# Altium project NC1-2BA.PrjPcb
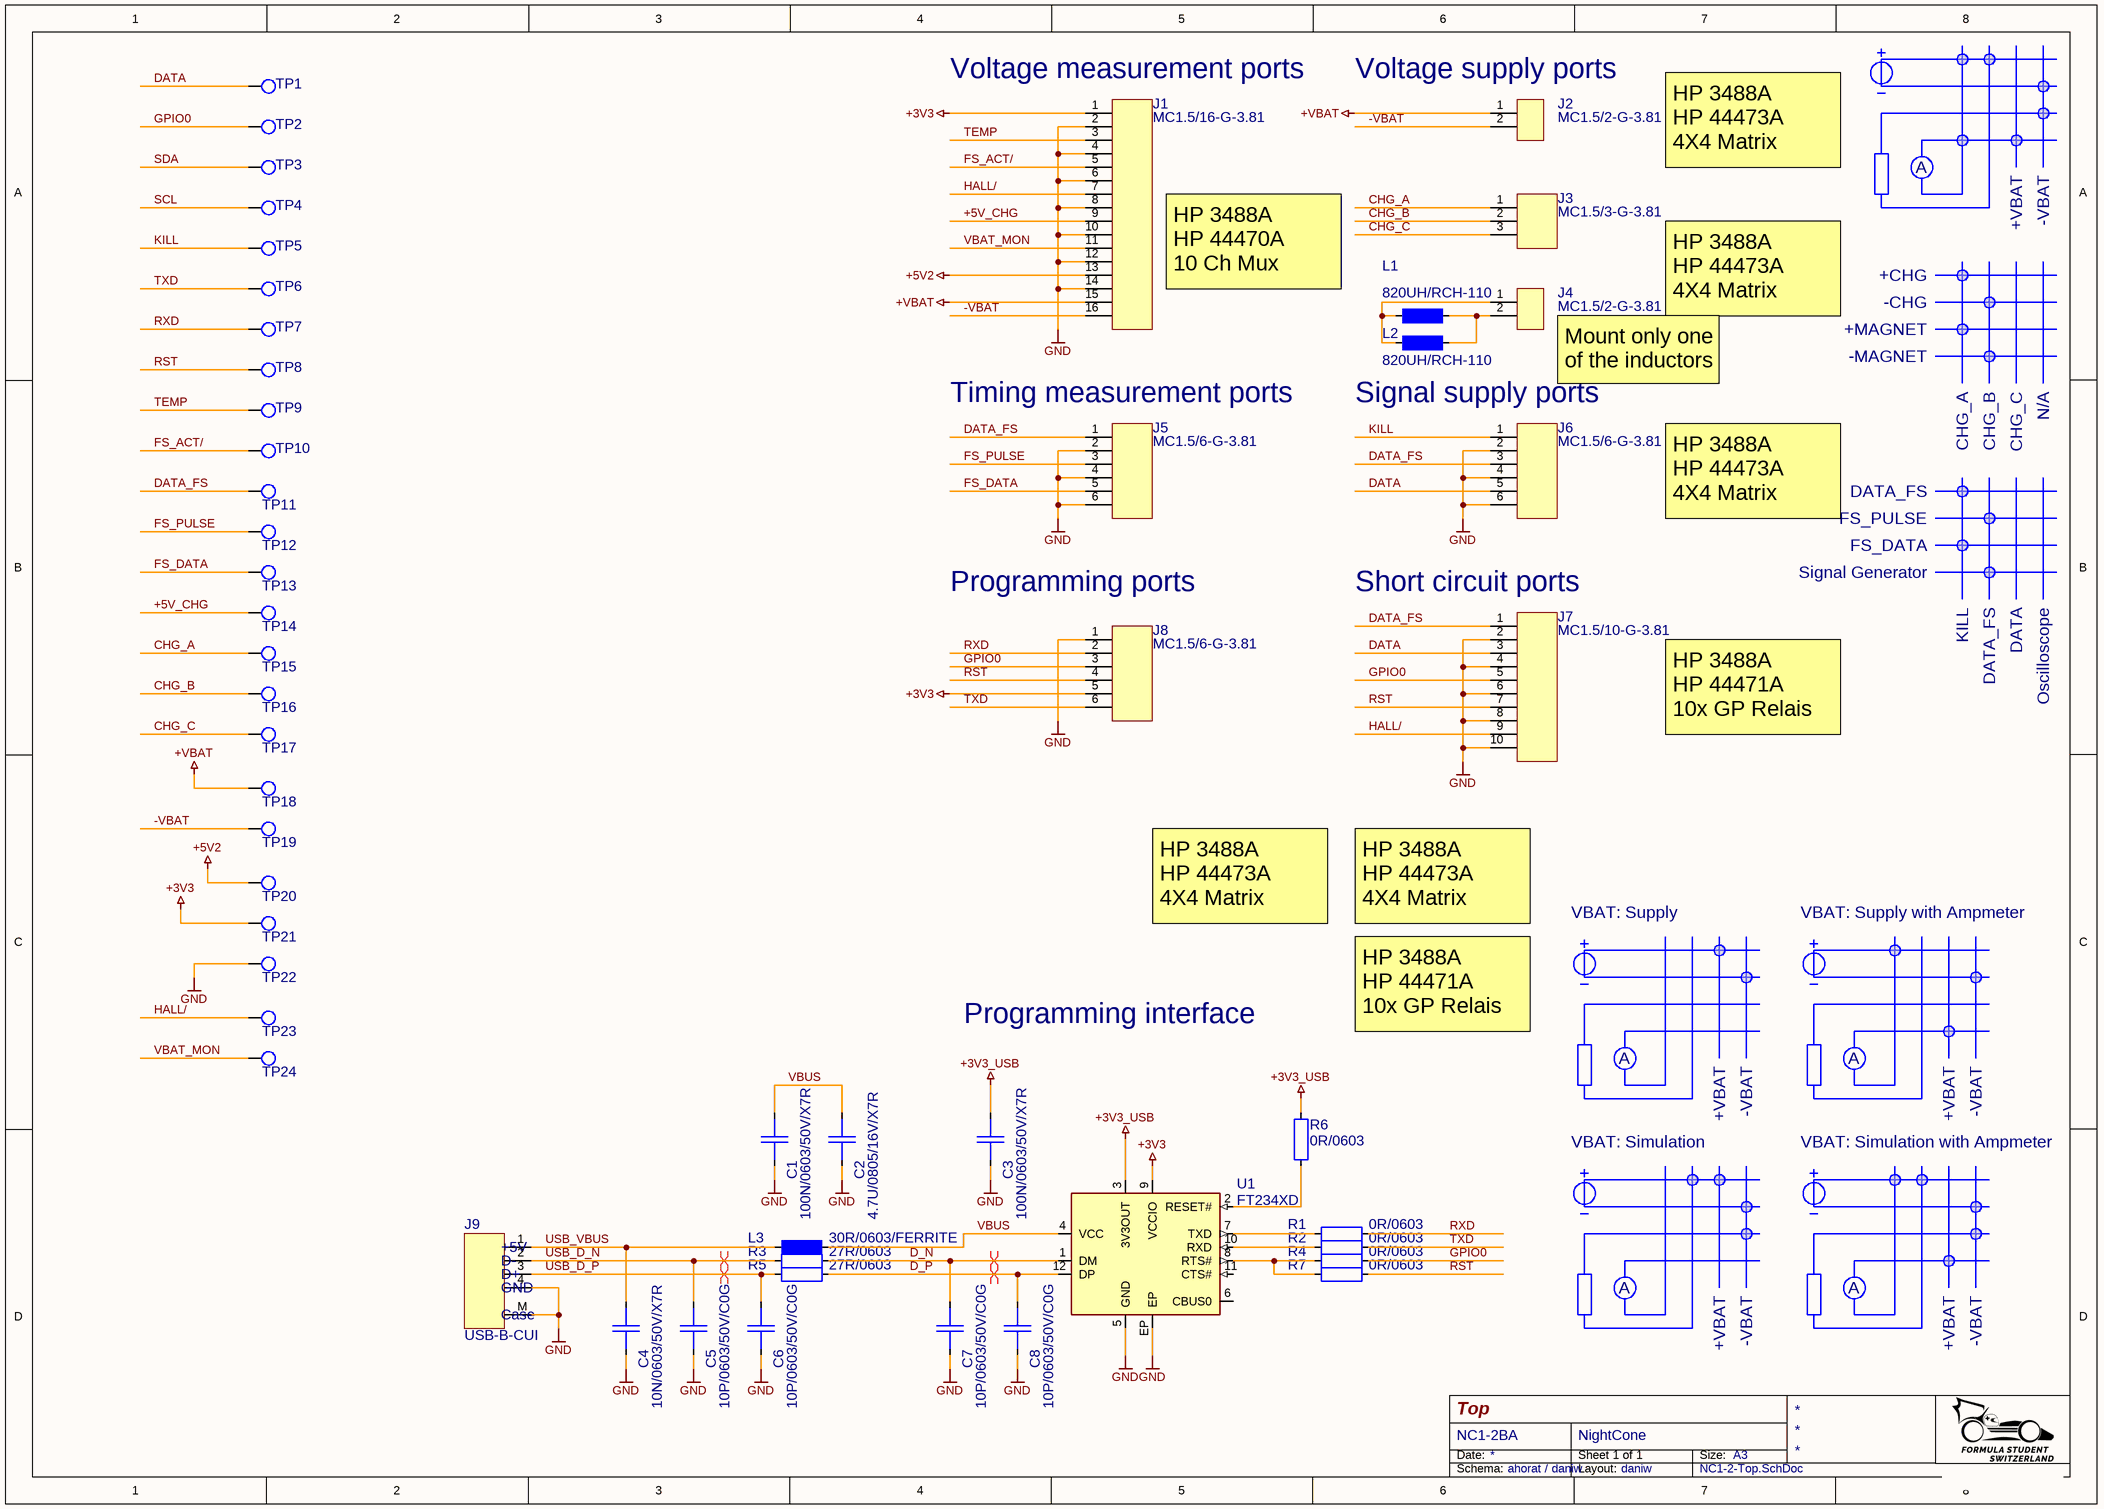
[diagram p0: NC1-2-Top.SchDoc]
Author: ahorat / daniw; Index_Main: B; Index_Sub: A; Layout_Designer: daniw; PCB_NAME: NC1-2; Project: NightCone; Schema_Designer: ahorat / daniw
1 sheet, 52 parts. Net scope: global (net labels, ports and power ports of the same name join across sheets).
Board files: NC1-2B-BASIS.PcbDoc, NC1-2B-PANEL.PcbDoc

## Sheet NC1-2-Top.SchDoc: Top
size A3; SheetNumber: 1; SheetTotal: 1

### Parts
C1  100N/0603/50V/X7R  [CAP0603_X7R]
C2  4.7U/0805/16V/X7R  [CAP0805_X7R]
C3  100N/0603/50V/X7R  [CAP0603_X7R]
C4  10N/0603/50V/X7R  [CAP0603_X7R]
C5  10P/0603/50V/C0G  [CAP0603_C0G]
C6  10P/0603/50V/C0G  [CAP0603_C0G]
C7  10P/0603/50V/C0G  [CAP0603_C0G]
C8  10P/0603/50V/C0G  [CAP0603_C0G]
J1  MC1.5/16-G-3.81  [MC1.5/16-G-3.81]
J2  MC1.5/2-G-3.81  [MC1.5/2-G-3.81]
J3  MC1.5/3-G-3.81  [MC1.5/3-G-3.81]
J4  MC1.5/2-G-3.81  [MC1.5/2-G-3.81]
J5  MC1.5/6-G-3.81  [MC1.5/6-G-3.81]
J6  MC1.5/6-G-3.81  [MC1.5/6-G-3.81]
J7  MC1.5/10-G-3.81  [MC1.5/10-G-3.81]
J8  MC1.5/6-G-3.81  [MC1.5/6-G-3.81]
J9  USB-B-CUI  [USB-B_CUI_UJ2-BH-TH]
L1  820UH/RCH-110  [RCH-110-SINGLE]
L2  820UH/RCH-110  [RCH-110-SINGLE]
L3  30R/0603/FERRITE  [FB0603]
R1  0R/0603  [R0603-0.40-WW]
R2  0R/0603  [R0603-0.40-WW]
R3  27R/0603  [R0603-0.40-WW]
R4  0R/0603  [R0603-0.40-WW]
R5  27R/0603  [R0603-0.40-WW]
R6  0R/0603  [R0603-0.40-WW]
R7  0R/0603  [R0603-0.40-WW]
TP1  SPRING-PROBE-SLEEVE-25  [TP_SPRING_PROBE_S25-512]  (value not drawn)  (no BOM)
TP2  SPRING-PROBE-SLEEVE-25  [TP_SPRING_PROBE_S25-512]  (value not drawn)  (no BOM)
TP3  SPRING-PROBE-SLEEVE-25  [TP_SPRING_PROBE_S25-512]  (value not drawn)  (no BOM)
TP4  SPRING-PROBE-SLEEVE-25  [TP_SPRING_PROBE_S25-512]  (value not drawn)  (no BOM)
TP5  SPRING-PROBE-SLEEVE-25  [TP_SPRING_PROBE_S25-512]  (value not drawn)  (no BOM)
TP6  SPRING-PROBE-SLEEVE-25  [TP_SPRING_PROBE_S25-512]  (value not drawn)  (no BOM)
TP7  SPRING-PROBE-SLEEVE-25  [TP_SPRING_PROBE_S25-512]  (value not drawn)  (no BOM)
TP8  SPRING-PROBE-SLEEVE-25  [TP_SPRING_PROBE_S25-512]  (value not drawn)  (no BOM)
TP9  SPRING-PROBE-SLEEVE-25  [TP_SPRING_PROBE_S25-512]  (value not drawn)  (no BOM)
TP10  SPRING-PROBE-SLEEVE-25  [TP_SPRING_PROBE_S25-512]  (value not drawn)  (no BOM)
TP11  SPRING-PROBE-SLEEVE-25  [TP_SPRING_PROBE_S25-512]  (value not drawn)  (no BOM)
TP12  SPRING-PROBE-SLEEVE-25  [TP_SPRING_PROBE_S25-512]  (value not drawn)  (no BOM)
TP13  SPRING-PROBE-SLEEVE-25  [TP_SPRING_PROBE_S25-512]  (value not drawn)  (no BOM)
TP14  SPRING-PROBE-SLEEVE-25  [TP_SPRING_PROBE_S25-512]  (value not drawn)  (no BOM)
TP15  SPRING-PROBE-SLEEVE-25  [TP_SPRING_PROBE_S25-512]  (value not drawn)  (no BOM)
TP16  SPRING-PROBE-SLEEVE-25  [TP_SPRING_PROBE_S25-512]  (value not drawn)  (no BOM)
TP17  SPRING-PROBE-SLEEVE-25  [TP_SPRING_PROBE_S25-512]  (value not drawn)  (no BOM)
TP18  SPRING-PROBE-SLEEVE-25  [TP_SPRING_PROBE_S25-512]  (value not drawn)  (no BOM)
TP19  SPRING-PROBE-SLEEVE-25  [TP_SPRING_PROBE_S25-512]  (value not drawn)  (no BOM)
TP20  SPRING-PROBE-SLEEVE-25  [TP_SPRING_PROBE_S25-512]  (value not drawn)  (no BOM)
TP21  SPRING-PROBE-SLEEVE-25  [TP_SPRING_PROBE_S25-512]  (value not drawn)  (no BOM)
TP22  SPRING-PROBE-SLEEVE-25  [TP_SPRING_PROBE_S25-512]  (value not drawn)  (no BOM)
TP23  SPRING-PROBE-SLEEVE-25  [TP_SPRING_PROBE_S25-512]  (value not drawn)  (no BOM)
TP24  SPRING-PROBE-SLEEVE-25  [TP_SPRING_PROBE_S25-512]  (value not drawn)  (no BOM)
U1  FT234XD  [DFN045P300X300X080-12-EP160X250]

### Nets
+3V3: J1.1 J8.5 TP21.1 U1.9(VCCIO)
+3V3_USB: C3.1 R6.1 U1.3(3V3OUT)
+5V2: J1.13 TP20.1
+VBAT: J1.15 J2.1 TP18.1
GND: C1.2 C2.2 C3.2 C4.2 C5.2 C6.2 C7.2 C8.2 J1.2 J1.4 J1.6 J1.8 J1.10 J1.12 J1.14 J5.2 J5.4 J5.6 J6.2 J6.4 J6.6 J7.2 J7.4 J7.6 J7.8 J7.10 J8.1 J9.4 J9.M TP22.1 U1.5(GND) U1.EP
+5V_CHG: J1.9 TP14.1
-VBAT: J1.16 J2.2 TP19.1
CHG_A: J3.1 TP15.1
CHG_B: J3.2 TP16.1
CHG_C: J3.3 TP17.1
D_N: C7.1 R3.2 U1.1(DM)
D_P: C8.1 R5.2 U1.12(DP)
DATA: J6.5 J7.3 TP1.1
DATA_FS: J5.1 J6.3 J7.1 TP11.1
FS_ACT/: J1.5 TP10.1
FS_DATA: J5.5 TP13.1
FS_PULSE: J5.3 TP12.1
GPIO0: J7.5 J8.3 R4.2 TP2.1
HALL/: J1.7 J7.9 TP23.1
KILL: J6.1 TP5.1
RST: J7.7 J8.4 R7.2 TP8.1
RXD: J8.2 R1.2 TP7.1
SCL: TP4.1
SDA: TP3.1
TEMP: J1.3 TP9.1
TXD: J8.6 R2.2 TP6.1
USB_D_N: C5.1 J9.2 R3.1
USB_D_P: C6.1 J9.3 R5.1
USB_VBUS: C4.1 J9.1 L3.1
VBAT_MON: J1.11 TP24.1
VBUS: C1.1 C2.1 L3.2 U1.4(VCC)
NetJ4_1: J4.1 L1.1 L2.1
NetJ4_2: J4.2 L1.2 L2.2
NetR1_1: R1.1 U1.7(TXD)
NetR2_1: R2.1 U1.10(RXD)
NetR4_1: R4.1 R7.1 U1.8(RTS#)
NetR6_2: R6.2 U1.2(RESET#)

Not connected (* = marked no-connect by the designer): U1 6(CBUS0) 11(CTS#)

### Layout directives
differential pair; differential pair class USB; rule Matched Net Lengths [Tolerance = 0.2mm]: D_N, D_P, USB_D_N, USB_D_P

### Notes on the sheet
- (near J1) Voltage measurement ports
- (near J2) Voltage supply ports
- HP 3488A
  HP 44473A
  4X4 Matrix
- A
- +VBAT
- -VBAT
- HP 3488A
  HP 44470A
  10 Ch Mux
- +CHG
- -CHG
- (near J4) Mount only one of the inductors
- +MAGNET
- -MAGNET
- (near J5) Timing measurement ports
- Signal supply ports
- CHG_A
- CHG_B
- CHG_C
- N/A
- DATA_FS
- FS_PULSE
- FS_DATA
- Signal Generator
- Programming ports
- (near J7) Short circuit ports
- KILL
- DATA
- Oscilloscope
- HP 3488A
  HP 44471A
  10x GP Relais
- VBAT: Supply
- VBAT: Supply with Ampmeter
- Programming interface
- VBAT: Simulation
- VBAT: Simulation with Ampmeter
- Date:
- Size:
- A3
- Schema:
- Layout:
- (in symbol USB-B-CUI) +5V; D-; D+; GND; Case

### Library data of the parts
C1 C3 = 100N/0603/50V/X7R: CAP SM 0603 100nF 50V X7R; Manufacturer: GENERIC; Manufacturer 1: YAGEO; Manufacturer Part Number 1: CC0603KPX7R9BB104; Absolute Value: 1E-7; Eurocircuits GPN: GPC0603104; Part Number: 100N/0603/50V/X7R; Package: 0603; Value: 100nF; HelpURL: https://www.yageo.com/upload/media/product/app/datasheet/mlcc/upy-gphc_x7r_6_3v-to-250v.pdf; Supplier 1: Digi-Key; Supplier Part Number 1: 311-3567-1-ND; Manufacturer 2: YAGEO; Manufacturer Part Number 2: CC0603MRX7R9BB104; Supplier 2: Digi-Key; Supplier Part Number 2: 311-4110-1-ND; Supplier 3: LCSC; Supplier Part Number 3: C14663; JLC Type: Basic
C2 = 4.7U/0805/16V/X7R: CAP SM 0805 4.7uF 16V X7R; Manufacturer: GENERIC; Manufacturer 1: Murata; Manufacturer Part Number 1: GRM21BR71C475KE51L; Absolute Value: 4.7E-6; Eurocircuits GPN: GPN0805475-16; Part Number: 4.7U/0805/16V/X7R; Package: 0805; Value: 4.7uF; HelpURL: https://search.murata.co.jp/Ceramy/image/img/A01X/G101/ENG/GRM21BR71C475KE51-01.pdf; Supplier 1: Digi-Key; Supplier Part Number 1: 490-14466-1-ND; Manufacturer Part Number 3: TCC0603X5R475M160CT; Supplier 3: LCSC; Supplier Part Number 3: C7393897
C4 = 10N/0603/50V/X7R: CAP SM 0603 10nF 50V X7R; Manufacturer: GENERIC; Manufacturer 1: YAGEO; Manufacturer Part Number 1: CC0603KPX7R9BB103; Absolute Value: 1E-8; Eurocircuits GPN: GPC0603103; Part Number: 10N/0603/50V/X7R; Package: 0603; Value: 10nF; HelpURL: https://www.yageo.com/upload/media/product/app/datasheet/mlcc/upy-gphc_x7r_6_3v-to-250v.pdf; Supplier 1: Digi-Key; Supplier Part Number 1: 311-1572-1-ND; Manufacturer 2: YAGEO; Manufacturer Part Number 2: CC0603KRX7R9BB103; Supplier 2: Digi-Key; Supplier Part Number 2: 311-1085-1-ND; Manufacturer Part Number 3: CC0603KRX7R9BB103; Supplier 3: LCSC; Supplier Part Number 3: C100042
C5-C8 = 10P/0603/50V/C0G: CAP SM 0603 10pF 50V C0G; Manufacturer: GENERIC; Manufacturer 1: YAGEO; Manufacturer Part Number 1: CC0603JRNPO9BN100; Absolute Value: 1E-11; Eurocircuits GPN: GPC0603100-C0G; Part Number: 10P/0603/50V/C0G; Package: 0603; Value: 10pF; HelpURL: https://www.yageo.com/upload/media/product/productsearch/datasheet/mlcc/UPY-GP_NP0_16V-to-50V_18.pdf; Supplier 1: Digi-Key; Supplier Part Number 1: 311-1058-1-ND; Manufacturer 2: YAGEO; Manufacturer Part Number 2: CC0603KRNPO9BN100; Supplier 2: Digi-Key; Supplier Part Number 2: 311-4025-1-ND
J1 = MC1.5/16-G-3.81: Phoenix contact MC 1,5/ 16-G-3,81; Manufacturer Part Number 1: 1803413; Part Number: MC1.5/16-G-3.81; HelpURL: https://www.phoenixcontact.com/en-us/products/pcb-header-mc-1516-g-381-1803413?type=pdf; Manufacturer 1: Phoenix; Supplier 1: Digi-Key; Supplier Part Number 1: 277-1220-ND; Manufacturer: Phoenix
J2 J4 = MC1.5/2-G-3.81: Phoenix contact MC 1,5/ 2-G-3,81; Manufacturer Part Number 1: 1803277; Part Number: MC1.5/2-G-3.81; HelpURL: https://www.phoenixcontact.com/en-us/products/pcb-header-mc-15-2-g-381-1803277?type=pdf; Manufacturer 1: Phoenix; Supplier 1: Digi-Key; Supplier Part Number 1: 277-1206-ND; Manufacturer: Phoenix
J3 = MC1.5/3-G-3.81: Phoenix contact MC 1,5/ 3-G-3,81; Manufacturer Part Number 1: 1803280; Part Number: MC1.5/3-G-3.81; Manufacturer: Phoenix; HelpURL: https://www.phoenixcontact.com/en-us/products/pcb-header-mc-15-3-g-381-1803280?type=pdf; Manufacturer 1: Phoenix; Supplier 1: Digi-Key; Supplier Part Number 1: 277-1207-ND
J5 J6 J8 = MC1.5/6-G-3.81: Phoenix contact MC 1,5/ 6-G-3,81; Manufacturer Part Number 1: 1803316; Part Number: MC1.5/6-G-3.81; HelpURL: https://www.phoenixcontact.com/en-us/products/pcb-header-mc-15-6-g-381-1803316?type=pdf; Manufacturer 1: Phoenix; Supplier 1: Digi-Key; Supplier Part Number 1: 277-1210-ND; Manufacturer: Phoenix
J7 = MC1.5/10-G-3.81: Phoenix contact MC 1,5/ 10-G-3,81; Manufacturer Part Number 1: 1803358; Part Number: MC1.5/10-G-3.81; HelpURL: https://www.phoenixcontact.com/en-us/products/pcb-header-mc-1510-g-381-1803358?type=pdf; Manufacturer 1: Phoenix; Supplier 1: Digi-Key; Supplier Part Number 1: 277-1214-ND; Manufacturer: Phoenix
J9 = USB-B-CUI: USB-B CUI UJ2-BH-TH; Manufacturer 1: CUI Devices; Manufacturer Part Number 1: UJ2-BH-1-TH; Part Number: USB-B-CUI; Manufacturer: CUI; HelpURL: https://www.cuidevices.com/product/resource/uj2-bh-th.pdf; Supplier 1: Digi-Key; Supplier Part Number 1: 102-3999-ND
L1 L2 = 820UH/RCH-110: 820UH unshielded inductor THT RCH-110; Manufacturer: Sumida; Manufacturer Part Number 1: RCH110NP-821K; Absolute Value: 0.00082; Part Number: 820UH/RCH-110; Package: RCH-110; Value: 820UH; HelpURL: https://products.sumida.com/products/pdf/RCH-110.pdf; Manufacturer 1: Sumida; Supplier 1: Digi-Key
L3 = 30R/0603/FERRITE: 30R@100MHz 5A 0603 Ferrite; Manufacturer: GENERIC; Manufacturer 1: Laird-Signal Integrity Products; Manufacturer Part Number 1: HI0603R300R-10; Value: 30R; Absolute Value: 1000; Part Number: 30R/0603/FERRITE; Package: 603; HelpURL: https://www.laird.com/document/datasheet/hi0603r300r-10-datasheet; Supplier 1: Digi-Key; Supplier Part Number 1: 240-HI0603R300R-10CT-ND
R1 R2 R4 R6 R7 = 0R/0603: RES SM 0603 0R; Manufacturer: GENERIC; Manufacturer 1: YAGEO; Manufacturer Part Number 1: RC0603FR-070RL; Absolute Value: 0; Eurocircuits GPN: GPR06030R; Part Number: 0R/0603; Package: 0603; Value: 0R; HelpURL: https://www.yageo.com/upload/media/product/app/datasheet/rchip/pyu-rc_group_51_rohs_l.pdf; Supplier 1: Digi-Key; Supplier Part Number 1: 311-0.0HRCT-ND; Manufacturer 2: YAGEO; Manufacturer Part Number 2: RC0603FR-130RL; Supplier 2: Digi-Key; Supplier Part Number 2: 13-RC0603FR-130RLCT-ND; Manufacturer 3: UNI-ROYAL(Uniroyal Elec); Manufacturer Part Number 3: 0603WAF0000T5E; Supplier 3: LCSC; Supplier Part Number 3: C21189; JLC Type: Basic
R3 R5 = 27R/0603: RES SM 0603 27R; Manufacturer: GENERIC; Manufacturer 1: YAGEO; Manufacturer Part Number 1: RC0603FR-1327RL; Absolute Value: 27; Eurocircuits GPN: GPR060327R; Part Number: 27R/0603; Package: 0603; Value: 27R; HelpURL: https://www.yageo.com/upload/media/product/productsearch/datasheet/rchip/PYu-RC_Group_51_RoHS_L_12.pdf; Supplier 1: Digi-Key; Supplier Part Number 1: 13-RC0603FR-1327RLCT-ND; Manufacturer 2: YAGEO; Manufacturer Part Number 2: RC0603FR-0727RL; Supplier 2: Digi-Key; Supplier Part Number 2: 311-27.0HRCT-ND
TP1-TP24 = SPRING-PROBE-SLEEVE-25: Manufacturer: Harwin; Manufacturer Part Number 1: S25-512; Part Number: SPRING-PROBE-SLEEVE-25; HelpURL: https://cdn.harwin.com/pdfs/S25-XX2.pdf; Manufacturer 1: Harwin; Supplier 1: Digi-Key; Supplier Part Number 1: 952-2294-ND
U1 = FT234XD: FT234XD USB TO BASIC UART IC; Manufacturer: FTDI; Manufacturer 1: FTDI, Future Technology Devices International Ltd; Manufacturer Part Number 1: FT234XD-R; Part Number: FT234XD; Package: DFN-12; HelpURL: https://www.ftdichip.com/Support/Documents/DataSheets/ICs/DS_FT234XD.pdf; Supplier 1: Digi-Key; Supplier Part Number 1: 768-1178-1-ND; Manufacturer 2: FTDI, Future Technology Devices International Ltd; Manufacturer Part Number 2: FT234XD-T; Supplier 2: Digi-Key; Supplier Part Number 2: 768-1345-ND